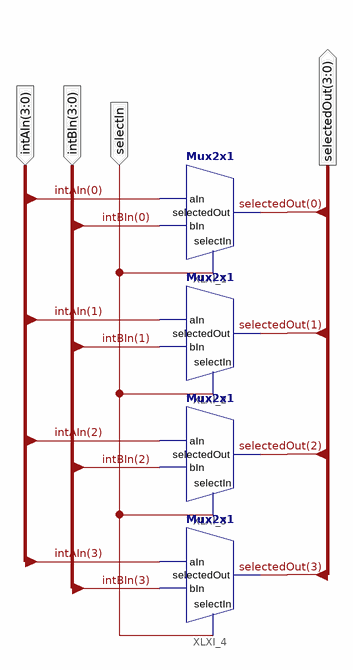
[diagram p0: schematic sheet 1]
// Xilinx ISE schematic Mux2x4b.sch (spartan3e) as structural Verilog: 4 symbols, 4 ports
module Mux2x4b (
  input  [3:0] intAIn,
  input  [3:0] intBIn,
  input  selectIn,
  output [3:0] selectedOut
);

  Mux2x1 XLXI_1 (.aIn(intAIn[0]), .bIn(intBIn[0]), .selectIn(selectIn), .selectedOut(selectedOut[0]));
  Mux2x1 XLXI_2 (.aIn(intAIn[1]), .bIn(intBIn[1]), .selectIn(selectIn), .selectedOut(selectedOut[1]));
  Mux2x1 XLXI_3 (.aIn(intAIn[2]), .bIn(intBIn[2]), .selectIn(selectIn), .selectedOut(selectedOut[2]));
  Mux2x1 XLXI_4 (.aIn(intAIn[3]), .bIn(intBIn[3]), .selectIn(selectIn), .selectedOut(selectedOut[3]));
endmodule
